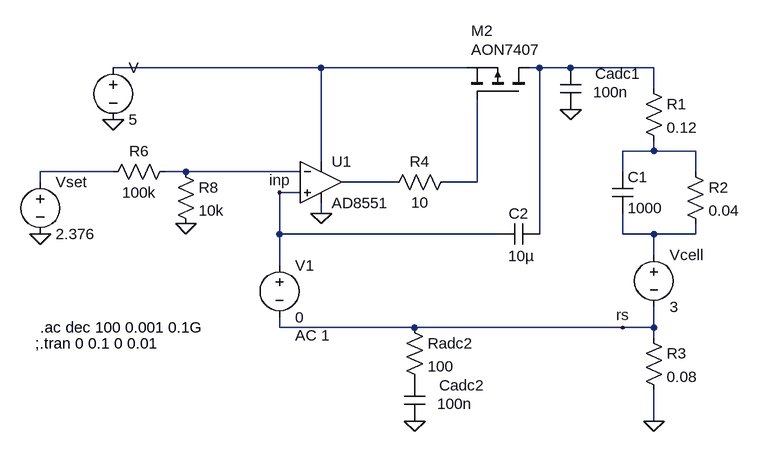
[diagram p0: schematic Draft1.asc]
Draft1.asc, the LTspice schematic file:
Version 4
SHEET 1 880 816
WIRE 48 16 -272 16
WIRE 272 16 48 16
WIRE 384 16 368 16
WIRE 432 16 384 16
WIRE 560 16 432 16
WIRE 560 48 560 16
WIRE 560 144 560 128
WIRE 560 144 512 144
WIRE 624 144 560 144
WIRE 48 160 48 16
WIRE -272 176 -384 176
WIRE -160 176 -192 176
WIRE 16 176 -160 176
WIRE 512 176 512 144
WIRE 624 176 624 144
WIRE -384 192 -384 176
WIRE 160 192 80 192
WIRE 288 192 288 64
WIRE 288 192 240 192
WIRE 16 208 -16 208
WIRE 48 240 48 224
WIRE -16 272 -16 208
WIRE 320 272 -16 272
WIRE 384 272 384 16
WIRE 512 272 512 240
WIRE 560 272 512 272
WIRE 624 272 624 256
WIRE 624 272 560 272
WIRE 560 304 560 272
WIRE -16 320 -16 272
WIRE -16 416 -16 400
WIRE 192 416 -16 416
WIRE 512 416 192 416
WIRE 560 416 560 384
WIRE 560 416 512 416
WIRE 560 432 560 416
WIRE 560 560 560 512
FLAG 560 560 0
FLAG 48 240 0
FLAG -384 272 0
FLAG 512 416 rs
FLAG -16 208 inp
FLAG 192 560 0
FLAG -160 256 0
FLAG -272 96 0
FLAG 432 80 0
SYMBOL voltage -384 176 R0
WINDOW 123 0 0 Left 0
WINDOW 39 0 0 Left 0
SYMATTR InstName Vset
SYMATTR Value 2.376
SYMBOL voltage -272 0 R0
WINDOW 123 0 0 Left 0
WINDOW 39 0 0 Left 0
SYMATTR InstName V
SYMATTR Value 5
SYMBOL pmos 368 64 M270
WINDOW 0 105 89 VLeft 2
WINDOW 3 76 89 VLeft 2
SYMATTR InstName M2
SYMATTR Value AON7407
SYMBOL Opamps\\AD8551 48 128 R0
SYMATTR InstName U1
SYMBOL res 544 32 R0
SYMATTR InstName R1
SYMATTR Value 0.12
SYMBOL voltage 560 288 R0
WINDOW 123 0 0 Left 0
WINDOW 39 0 0 Left 0
SYMATTR InstName Vcell
SYMATTR Value 3
SYMBOL res 608 160 R0
SYMATTR InstName R2
SYMATTR Value 0.04
SYMBOL cap 496 176 R0
SYMATTR InstName C1
SYMATTR Value 1000
SYMBOL res 544 416 R0
SYMATTR InstName R3
SYMATTR Value 0.08
SYMATTR SpiceLine tol=1 pwr=3
SYMBOL res 256 176 R90
WINDOW 0 0 56 VBottom 2
WINDOW 3 32 56 VTop 2
SYMATTR InstName R4
SYMATTR Value 10
SYMBOL voltage -16 304 R0
WINDOW 123 24 124 Left 2
WINDOW 39 0 0 Left 0
SYMATTR Value2 AC 1
SYMATTR InstName V1
SYMATTR Value 0
SYMBOL res 176 400 R0
SYMATTR InstName Radc2
SYMATTR Value 100
SYMBOL cap 176 496 R0
WINDOW 0 54 9 Left 2
WINDOW 3 51 37 Left 2
SYMATTR InstName Cadc2
SYMATTR Value 100n
SYMBOL res -176 160 R90
WINDOW 0 0 56 VBottom 2
WINDOW 3 32 56 VTop 2
SYMATTR InstName R6
SYMATTR Value 100k
SYMBOL res -176 160 R0
SYMATTR InstName R8
SYMATTR Value 10k
SYMBOL cap 384 256 R90
WINDOW 0 0 32 VBottom 2
WINDOW 3 65 28 VBottom 2
SYMATTR InstName C2
SYMATTR Value 10µ
SYMBOL cap 416 16 R0
WINDOW 0 54 9 Left 2
WINDOW 3 51 37 Left 2
SYMATTR InstName Cadc1
SYMATTR Value 100n
TEXT -384 416 Left 2 !.ac dec 100 0.001 0.1G
TEXT -392 440 Left 2 !;.tran 0 0.1 0 0.01

The netlist it stands for:
* Draft1.asc
Vset N004 0 2.376
V N001 0 5
M2 N002 N007 N001 N001 AON7407
XU1 inp N005 N001 0 N006 AD8551  ; pins In+ In- V+ V- OUT
R1 N002 N003 0.12
Vcell N008 rs 3
R2 N003 N008 0.04
C1 N003 N008 1000
R3 rs 0 0.08 tol=1 pwr=3
R4 N007 N006 10
V1 inp rs 0 AC 1
Radc2 rs P001 100
Cadc2 P001 0 100n
R6 N005 N004 100k
R8 N005 0 10k
C2 N002 inp 10µ
Cadc1 N002 0 100n
.model NMOS NMOS
.model PMOS PMOS
.lib standard.mos
.ac dec 100 0.001 0.1G
;.tran 0 0.1 0 0.01
.backanno
.end